# Altium schematic sheet Cheater Motor Driver.SchDoc: Cheater Motor Driver
size OrCAD A; DocumentNumber: ZLS-018; Revision: A; SheetNumber: 3; SheetTotal: 3; ProjectName: ZLS-018
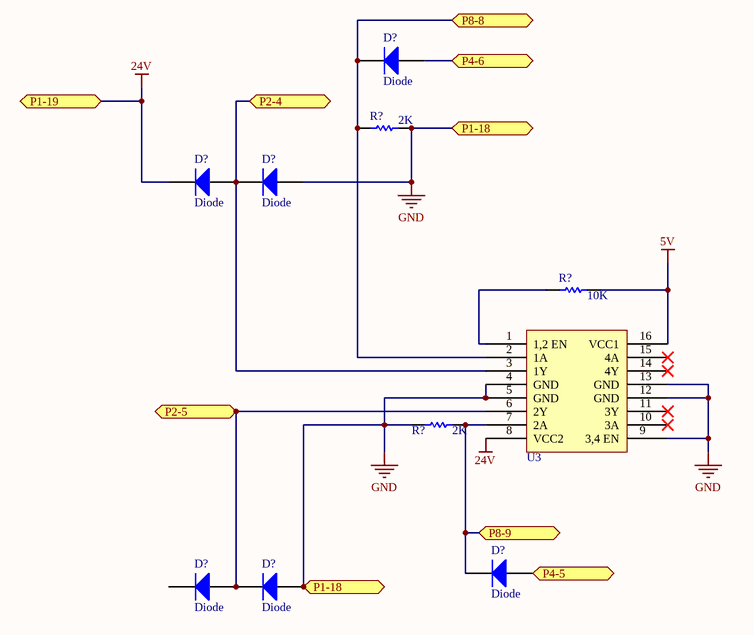
[diagram p0: Cheater Motor Driver.SchDoc]

## Parts
(Parts that share a designator on the sheet are numbered #1, #2 ... from top to bottom, then left to right.)
D?#1  Diode  [SMC]
D?#2  Diode  [SMC]
D?#3  Diode  [SMC]
D?#4  Diode  [SMC]
D?#5  Diode  [SMC]
D?#6  Diode  [SMC]
R?#1  value 2K  [AXIAL-0.3]  (hidden comment: Res1)
R?#2  value 10K  [AXIAL-0.3]  (hidden comment: Res1)
R?#3  value 2K  [AXIAL-0.3]  (hidden comment: Res1)
U3  SN754410  [DIP-16-KEY]  (value not drawn)

## Ports
P1-18, P1-19, P2-4, P2-5, P4-5, P4-6, P8-8, P8-9

## Nets
5V: R?#2.2 U3.16(VCC1)
24V: D?#2.2(K) U3.8(VCC2) ; port P1-19
GND: D?#3.1(A) D?#6.1(A) R?#1.2 R?#3.1 U3.4(GND) U3.5(GND) U3.9(3,4_EN) U3.12(GND) U3.13(GND) ; port P1-18
P2-4: D?#2.1(A) D?#3.2(K) U3.3(1Y) ; port P2-4
P2-5: D?#5.1(A) D?#6.2(K) U3.6(2Y) ; port P2-5
P4-5: D?#4.1(A) ; port P4-5
P4-6: D?#1.1(A) ; port P4-6
P8-8: D?#1.2(K) R?#1.1 U3.2(1A) ; port P8-8
P8-9: D?#4.2(K) R?#3.2 U3.7(2A) ; port P8-9
NetR?#2_1: R?#2.1 U3.1(1,2_EN)

Not connected (* = marked no-connect by the designer): D?#5 2(K); U3 10(3A)* 11(3Y)* 14(4Y)* 15(4A)*

## Notes on the sheet
- Title
- Size:
- Date:
- Orcad A
- Number:
- Time:
- Revision:
- Sheet
- of
- ZLS Corporation
- 7801 North Lamar Blvd.
- Suite E-184
- Austin, Texas 78752  USA
- (512) 453-0288
- File:

## Library data of the parts
D?#1-D?#6 = Diode: Default Diode; Published: 8-Jun-2000; LatestRevisionDate: 17-Jul-2002; LatestRevisionNote: Re-released for DXP Platform.; PackageVersion: Sep-1996; PackageReference: SMC; Publisher: Altium Limited; PackageDescription: DO-214-AB/SMC; 2 C-Bend Leads; Body 7.9 x 5.9 mm, inc. leads (LxW); Code_JEDEC: DO-214-AB
R?#1-R?#3 = Res1: Resistor; Published: 8-Jun-2000; LatestRevisionDate: 17-Jul-2002; LatestRevisionNote: Re-released for DXP Platform.; PackageReference: AXIAL-0.3; Publisher: Altium Limited; PackageDescription: Axial Device, Thru-Hole; 2 Leads; 0.3 in Pin Spacing